# Altium schematic sheet Amp.SchDoc
size A4; SheetNumber: 4; SheetTotal: 5
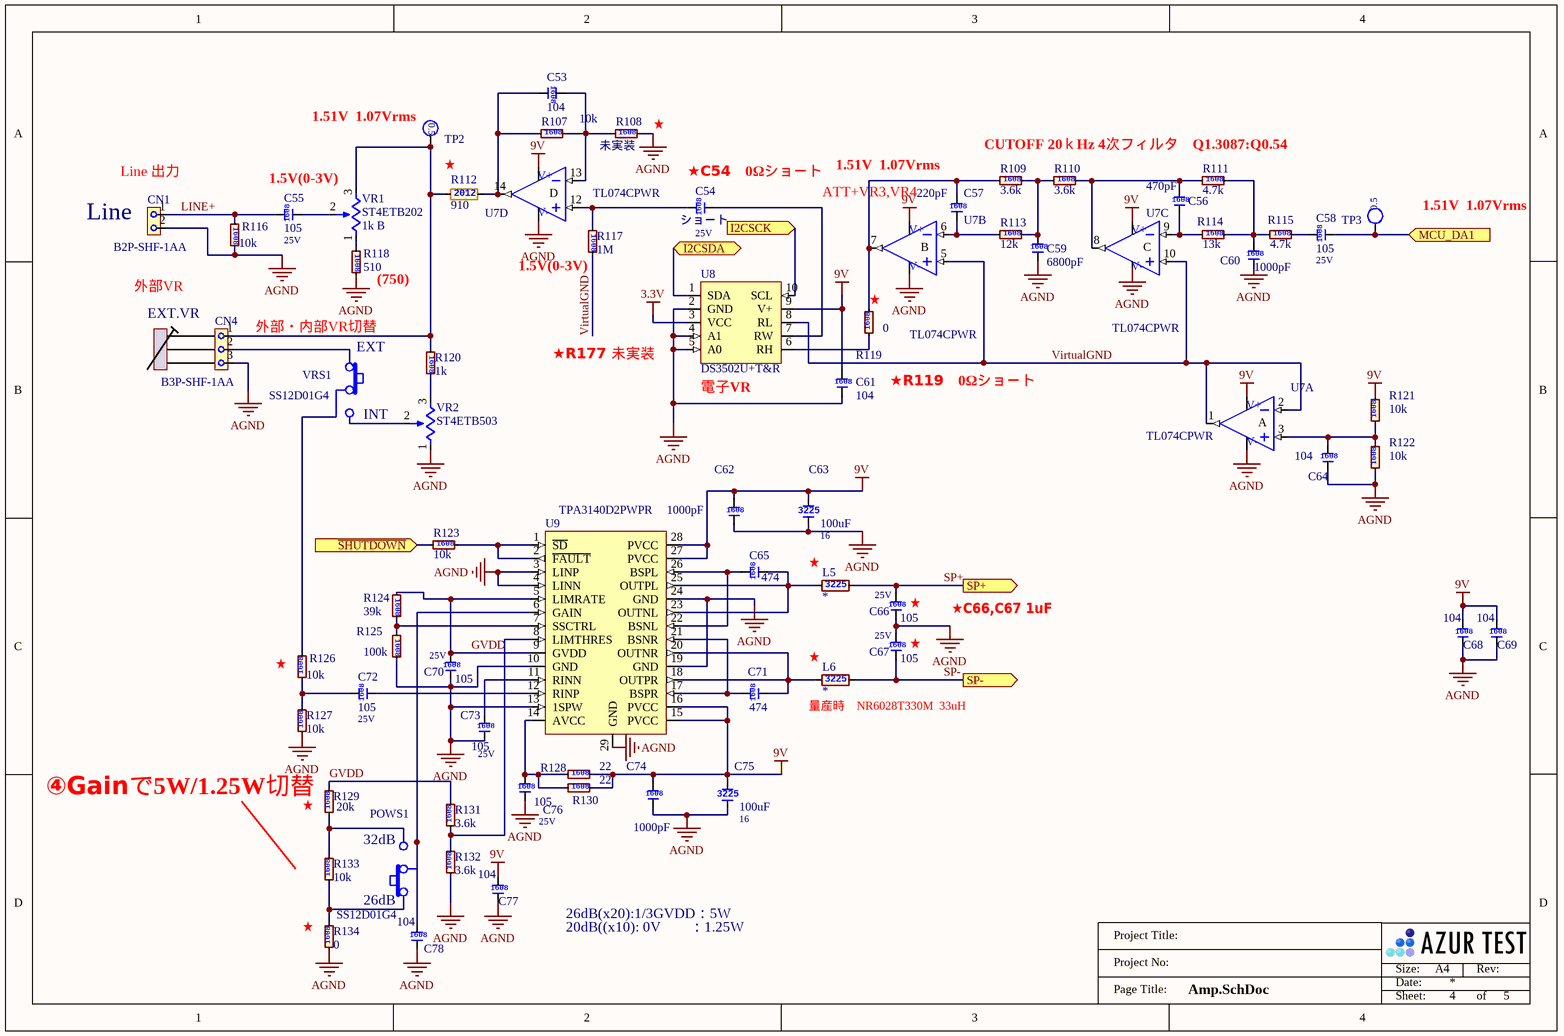
[diagram p0: Amp.SchDoc]

## Parts
C53  Tag: 104  [C1608]  (hidden comment: CGA3E2X7R1H104K080AA)
C54  Tag: ショート  Voltage: 25V  [C1608]  (hidden comment: TMK107BJ105MA-T)
C55  Tag: 105  Voltage: 25V  [C1608]  (hidden comment: TMK107BJ105MA-T)
C56  Tag: 470pF  [C1608]  (hidden comment: GCM1885C2A471JA16D)
C57  Tag: 220pF  [C1608]  (hidden comment: GCM1885C2A221JA16D)
C58  Tag: 105  Voltage: 25V  [C1608]  (hidden comment: TMK107BJ105MA-T)
C59  Tag: 6800pF  [C1608]  (hidden comment: GCM1885C2A682JA16D)
C60  Tag: 1000pF  [C1608]  (hidden comment: GCM1885C2A102JA16D)
C61  Tag: 104  [C1608]  (hidden comment: CGA3E2X7R1H104K080AA)
C62  Tag: 1000pF  [C1608]  (hidden comment: GCM1885C2A102JA16D)
C63  Tag: 100uF  Voltage: 16  [C3225]  (hidden comment: EMK325ABJ107MM-T)
C64  Tag: 104  [C1608]  (hidden comment: CGA3E2X7R1H104K080AA)
C65  Tag: 474  [C1608]  (hidden comment: UMK107B7474KA-TR)
C66  Tag: 105  Voltage: 25V  [C1608]  (hidden comment: TMK107BJ105MA-T)
C67  Tag: 105  Voltage: 25V  [C1608]  (hidden comment: TMK107BJ105MA-T)
C68  Tag: 104  [C1608]  (hidden comment: CGA3E2X7R1H104K080AA)
C69  Tag: 104  [C1608]  (hidden comment: CGA3E2X7R1H104K080AA)
C70  Tag: 105  Voltage: 25V  [C1608]  (hidden comment: TMK107BJ105MA-T)
C71  Tag: 474  [C1608]  (hidden comment: UMK107B7474KA-TR)
C72  Tag: 105  Voltage: 25V  [C1608]  (hidden comment: TMK107BJ105MA-T)
C73  Tag: 105  Voltage: 25V  [C1608]  (hidden comment: TMK107BJ105MA-T)
C74  Tag: 1000pF  [C1608]  (hidden comment: GCM1885C2A102JA16D)
C75  Tag: 100uF  Voltage: 16  [C3225]  (hidden comment: EMK325ABJ107MM-T)
C76  Tag: 105  Voltage: 25V  [C1608]  (hidden comment: TMK107BJ105MA-T)
C77  Tag: 104  [C1608]  (hidden comment: CGA3E2X7R1H104K080AA)
C78  Tag: 104  [C1608]  (hidden comment: CGA3E2X7R1H104K080AA)
CN1  B2P-SHF-1AA  [B2P-SHF-1AA]
CN4  B3P-SHF-1AA  [B3P-SHF-1AA]
L5  TF3225  [R3225]  (value not drawn)
L6  TF3225  [R3225]  (value not drawn)
POWS1  SS12D01G4  [SS12D01G4]
R107  Tag: 10k  [R1608]  (hidden comment: ERJ-PA3F1002V)
R108  Tag: 未実装  [R1608]  (hidden comment: ERJ-PA3F1002V)  (net tie, no BOM)
R109  Tag: 3.6k  [R1608]  (hidden comment: ERJ-PA3F3601V)
R110  Tag: 3.6k  [R1608]  (hidden comment: ERJ-PA3F3601V)
R111  Tag: 4.7k  [R1608]  (hidden comment: ERJ-PA3F4701V)
R112  Tag: 910  [R2012]  (hidden comment: ERJ-P08J911V)
R113  Tag: 12k  [R1608]  (hidden comment: ERJ-PA3F1201V)
R114  Tag: 13k  [R1608]  (hidden comment: ERJ-PA3F1302V)
R115  Tag: 4.7k  [R1608]  (hidden comment: ERJ-PA3F4701V)
R116  Tag: 10k  [R1608]  (hidden comment: ERJ-PA3F1002V)
R117  Tag: 1M  [R1608]  (hidden comment: ERJ-PA3F1004V)
R118  Tag: 510  [R1608]  (hidden comment: ERJ-PA3F5100V)
R119  Tag: 0  [R1608]  (hidden comment: ERJ-S030R00V)
R120  Tag: 1k  [R1608]  (hidden comment: ERJ-PA3F1001V)
R121  Tag: 10k  [R1608]  (hidden comment: ERJ-PA3F1002V)
R122  Tag: 10k  [R1608]  (hidden comment: ERJ-PA3F1002V)
R123  Tag: 10k  [R1608]  (hidden comment: ERJ-PA3F1002V)
R124  Tag: 39k  [R1608]  (hidden comment: ERJ-PA3F3902V)
R125  Tag: 100k  [R1608]  (hidden comment: ERJ-PA3F3902V)
R126  Tag: 10k  [R1608]  (hidden comment: ERJ-PA3F1002V)
R127  Tag: 10k  [R1608]  (hidden comment: ERJ-PA3F1002V)
R128  Tag: 22  [R1608]  (hidden comment: ERJ-PA3F22R0V)
R129  Tag: 20k  [R1608]  (hidden comment: ERJ-PA3F2002V)
R130  Tag: 22  [R1608]  (hidden comment: ERJ-PA3F22R0V)
R131  Tag: 3.6k  [R1608]  (hidden comment: ERJ-PA3F3601V)
R132  Tag: 3.6k  [R1608]  (hidden comment: ERJ-PA3F3601V)
R133  Tag: 10k  [R1608]  (hidden comment: ERJ-PA3F1002V)
R134  Tag: 0  [R1608]  (hidden comment: ERJ-S030R00V)
TP2  TP0.5mm  [TP0.5mm]  (value not drawn)  (no BOM)
TP3  TP0.5mm  [TP0.5mm]  (value not drawn)  (no BOM)
U7  TL074CPWR  [TSSOP14]  (parts A,B,C,D of 4)
U8  DS3502U+T&R  [MSOP10]
U9  TPA3140D2PWPR  [TSSOP28]
VR1  ST4ETB202  Tag: 1k B  [ST4ETB202]
VR2  ST4ETB503  [ST4ETB202]
VRS1  SS12D01G4  [SS12D01G4]

## Ports
I2CSCK (in), I2CSDA (bidir), MCU_DA1 (in), SP+ (out), SP- (out), ~{SHUTDOWN} (in)

## Nets
3.3V: U8.3(VCC)
9V: C61.2 C62.2 C63.2 C68.2 C69.2 C74.2 C75.2 C77.2 R121.2 R128.2 R130.2 U7.4(V+) U8.9(V+) U9.15(PVCC) U9.16(PVCC) U9.27(PVCC) U9.28(PVCC)
AGND: C59.1 C60.1 C61.1 C62.1 C63.1 C64.1 C66.1 C67.2 C68.1 C69.1 C70.1 C73.1 C74.1 C75.1 C76.1 C77.1 C78.1 CN1.2 CN4.3 R108.2 R116.2 R118.2 R122.1 R125.2 R127.1 R132.1 R134.1 U7.11(V-) U8.2(GND) U8.4(A1) U8.5(A0) U9.3(LINP) U9.4(LINN) U9.10(GND) U9.13(1SPW) U9.19(GND) U9.24(GND) U9.29(GND) VR2.1
GVDD: C70.2 R124.1 R129.2 R131.2 U9.5(LIMRATE) U9.9(GVDD)
I2CSCK: U8.10(SCL) ; port I2CSCK
I2CSDA: U8.1(SDA) ; port I2CSDA
LINE+: C55.2 CN1.1 R116.1
MCU_DA1: C58.1 TP3.1 ; port MCU_DA1
~{SHUTDOWN}: R123.1 ; port ~{SHUTDOWN}
SP+: C66.2 L5.2 ; port SP+
SP-: C67.1 L6.2 ; port SP-
VirtualGND: R117.2 U7.1(OUT) U7.2(IN-) U7.5(IN+) U7.10(IN+) U8.8(RL)
NetC53_1: C53.1 R107.1 R112.2 U7.14(OUT)
NetC53_2: C53.2 R107.2 R108.1 U7.13(IN-)
NetC54_1: C54.1 U8.7(RW)
NetC54_2: C54.2 R117.1 U7.12(IN+)
NetC55_1: C55.1 VR1.2
NetC56_1: C56.1 R114.1 U7.9(IN-)
NetC56_2: C56.2 R110.2 R111.1 U7.8(OUT)
NetC57_1: C57.1 R113.1 U7.6(IN-)
NetC57_2: C57.2 R109.1 R119.2 U7.7(OUT)
NetC58_2: C58.2 R115.2
NetC59_2: C59.2 R109.2 R110.1 R113.2
NetC60_2: C60.2 R111.2 R114.2 R115.1
NetC64_2: C64.2 R121.1 R122.2 U7.3(IN+)
NetC65_1: C65.1 L5.1 U9.23(OUTNL) U9.25(OUTPL)
NetC65_2: C65.2 U9.22(BSNL) U9.26(BSPL)
NetC71_1: C71.1 L6.1 U9.18(OUTPR) U9.20(OUTNR)
NetC71_2: C71.2 U9.17(BSPR) U9.21(BSNR)
NetC72_1: C72.1 U9.12(RINP)
NetC72_2: C72.2 R126.1 R127.2
NetC73_2: C73.2 U9.11(RINN)
NetC76_2: C76.2 R128.1 R130.1 U9.14(AVCC)
NetC78_2: C78.2 POWS1.2 U9.6(GAIN)
NetCN4_1: CN4.1 R112.1 R120.1 TP2.1 VR1.3
NetCN4_2: CN4.2 VRS1.1
NetPOWS1_1: POWS1.1 R133.1 R134.2
NetPOWS1_3: POWS1.3 R129.1 R133.2
NetR118_1: R118.1 VR1.1
NetR119_1: R119.1 U8.6(RH)
NetR120_2: R120.2 VR2.3
NetR123_2: R123.2 U9.1(~{SD}) U9.2(~{FAULT})
NetR124_2: R124.2 R125.1 U9.7(SSCTRL)
NetR126_2: R126.2 VRS1.2
NetR131_1: R131.1 R132.2 U9.8(LIMTHRES)
NetVR2_2: VR2.2 VRS1.3

## Notes on the sheet
- (near CN1) Line 出力
- (near TP2) 1.51V  1.07Vrms
- ★
- (near R108) ★
- (near C54) ★C54　0Ωショート
- (near C57) 1.51V  1.07Vrms
- CUTOFF 20ｋHz 4次フィルタ　Q1.3087:Q0.54
- (near CN1) Line
- (near VR1) 1.5V(0-3V)
- (near C54) ATT+VR3,VR4
- (near TP3) 1.51V  1.07Vrms
- 外部VR
- (near R118) (750)
- 1.5V(0-3V)
- (near R119) ★
- (near CN4) EXT.VR
- 外部・内部VR切替
- (near VRS1) EXT
- ★R177 未実装
- ★R119　0Ωショート
- (near VRS1) INT
- (near U8) 電子VR
- (near L5) ★
- (near C66) ★
- (near C67) ★
- ★C66,C67 1uF
- (near R126) ★
- (near L6) ★
- (near L6) 量産時　NR6028T330M  33uH
- ④Gainで5W/1.25W切替
- (near R129) ★
- (near POWS1) 32dB
- (near POWS1) 26dB
- 26dB(x20):1/3GVDD：5W
- (near R134) ★
- 20dB((x10): 0V　　：1.25W
- Labels drawn without touching a wire or pin: AGND
- Project Title:
- Project No:
- Size:
- Date:
- A4
- Rev:
- Page Title:
- Sheet:
- of
- (in symbol C1608) 1608
- (in symbol C3225) 3225
- (in symbol MF2012) 2012
- (in symbol TF1608) 1608
- (in symbol TF3225) 3225
- (in symbol TL084CPT, part A) A
- (in symbol TL084CPT, part B) B
- (in symbol TL084CPT, part C) C
- (in symbol TL084CPT, part D) D
- (in symbol TP0.5mm) 0.5

## Library data of the parts
C53 C61 C64 C68 C69 C77 C78 = C1608: セラコン1608サイズ; Vendor: TDK; Voltage: 50V
C54 C55 C58 C66 C67 C70 C72 C73 C76 = C1608: セラコン1608サイズ; Vendor: TaiyoYuden
C56 C57 C59 C60 C62 C74 = C1608: セラコン1608サイズ; Vendor: Murata; Voltage: 100V
C63 C75 = C3225: セラコン3225サイズ; Vendor: TaiyoYuden
C65 C71 = C1608: セラコン1608サイズ; Vendor: TiyoYuden; Voltage: 25V
CN1 = B2P-SHF-1AA: 雄,ストレート,1列2ピン; Vendor: JST
CN4 = B3P-SHF-1AA: 雄,ストレート,1列3ピン; Vendor: JST
L5 L6 = TF3225: 厚膜チップ抵抗3225サイズ; Vendor: *; Tag: *
POWS1 VRS1 = SS12D01G4: SPDTスライドスイッチ; Vendor: 秋月¦
R107-R111 R113-R134 = TF1608: 厚膜チップ抵抗1608サイズ; Vendor: Panasonic
R112 = MF2012: 薄膜チップ抵抗2012サイズ; Vendor: Panasonic
TP2 TP3 = TP0.5mm: Test-Point 0.5mm
U7 = TL084CPT: IC OPAMP JFET 4 CIRCUIT 14TSSOP; Vendor: Texas Instruments
U8 = DS3502U+T&R: IC DGTL POT 10KOHM 128TAP 10UMAX; Vendor: Maxim Integrated
U9 = TPA3140D2PWPR: IC AMP CLASS D STER 10W 28HTSSOP; Vendor: Texas Instruments
VR1 = ST-32EA**: CERMET TRIMMER  Top adjustmet; Vendor: Copal
VR2 = ST-32EA**: CERMET TRIMMER  Top adjustmet; Vendor: Copal; Tag: ***